# Altium schematic sheet PAGE2-CPU.SchDoc
size 513 x 386 mm
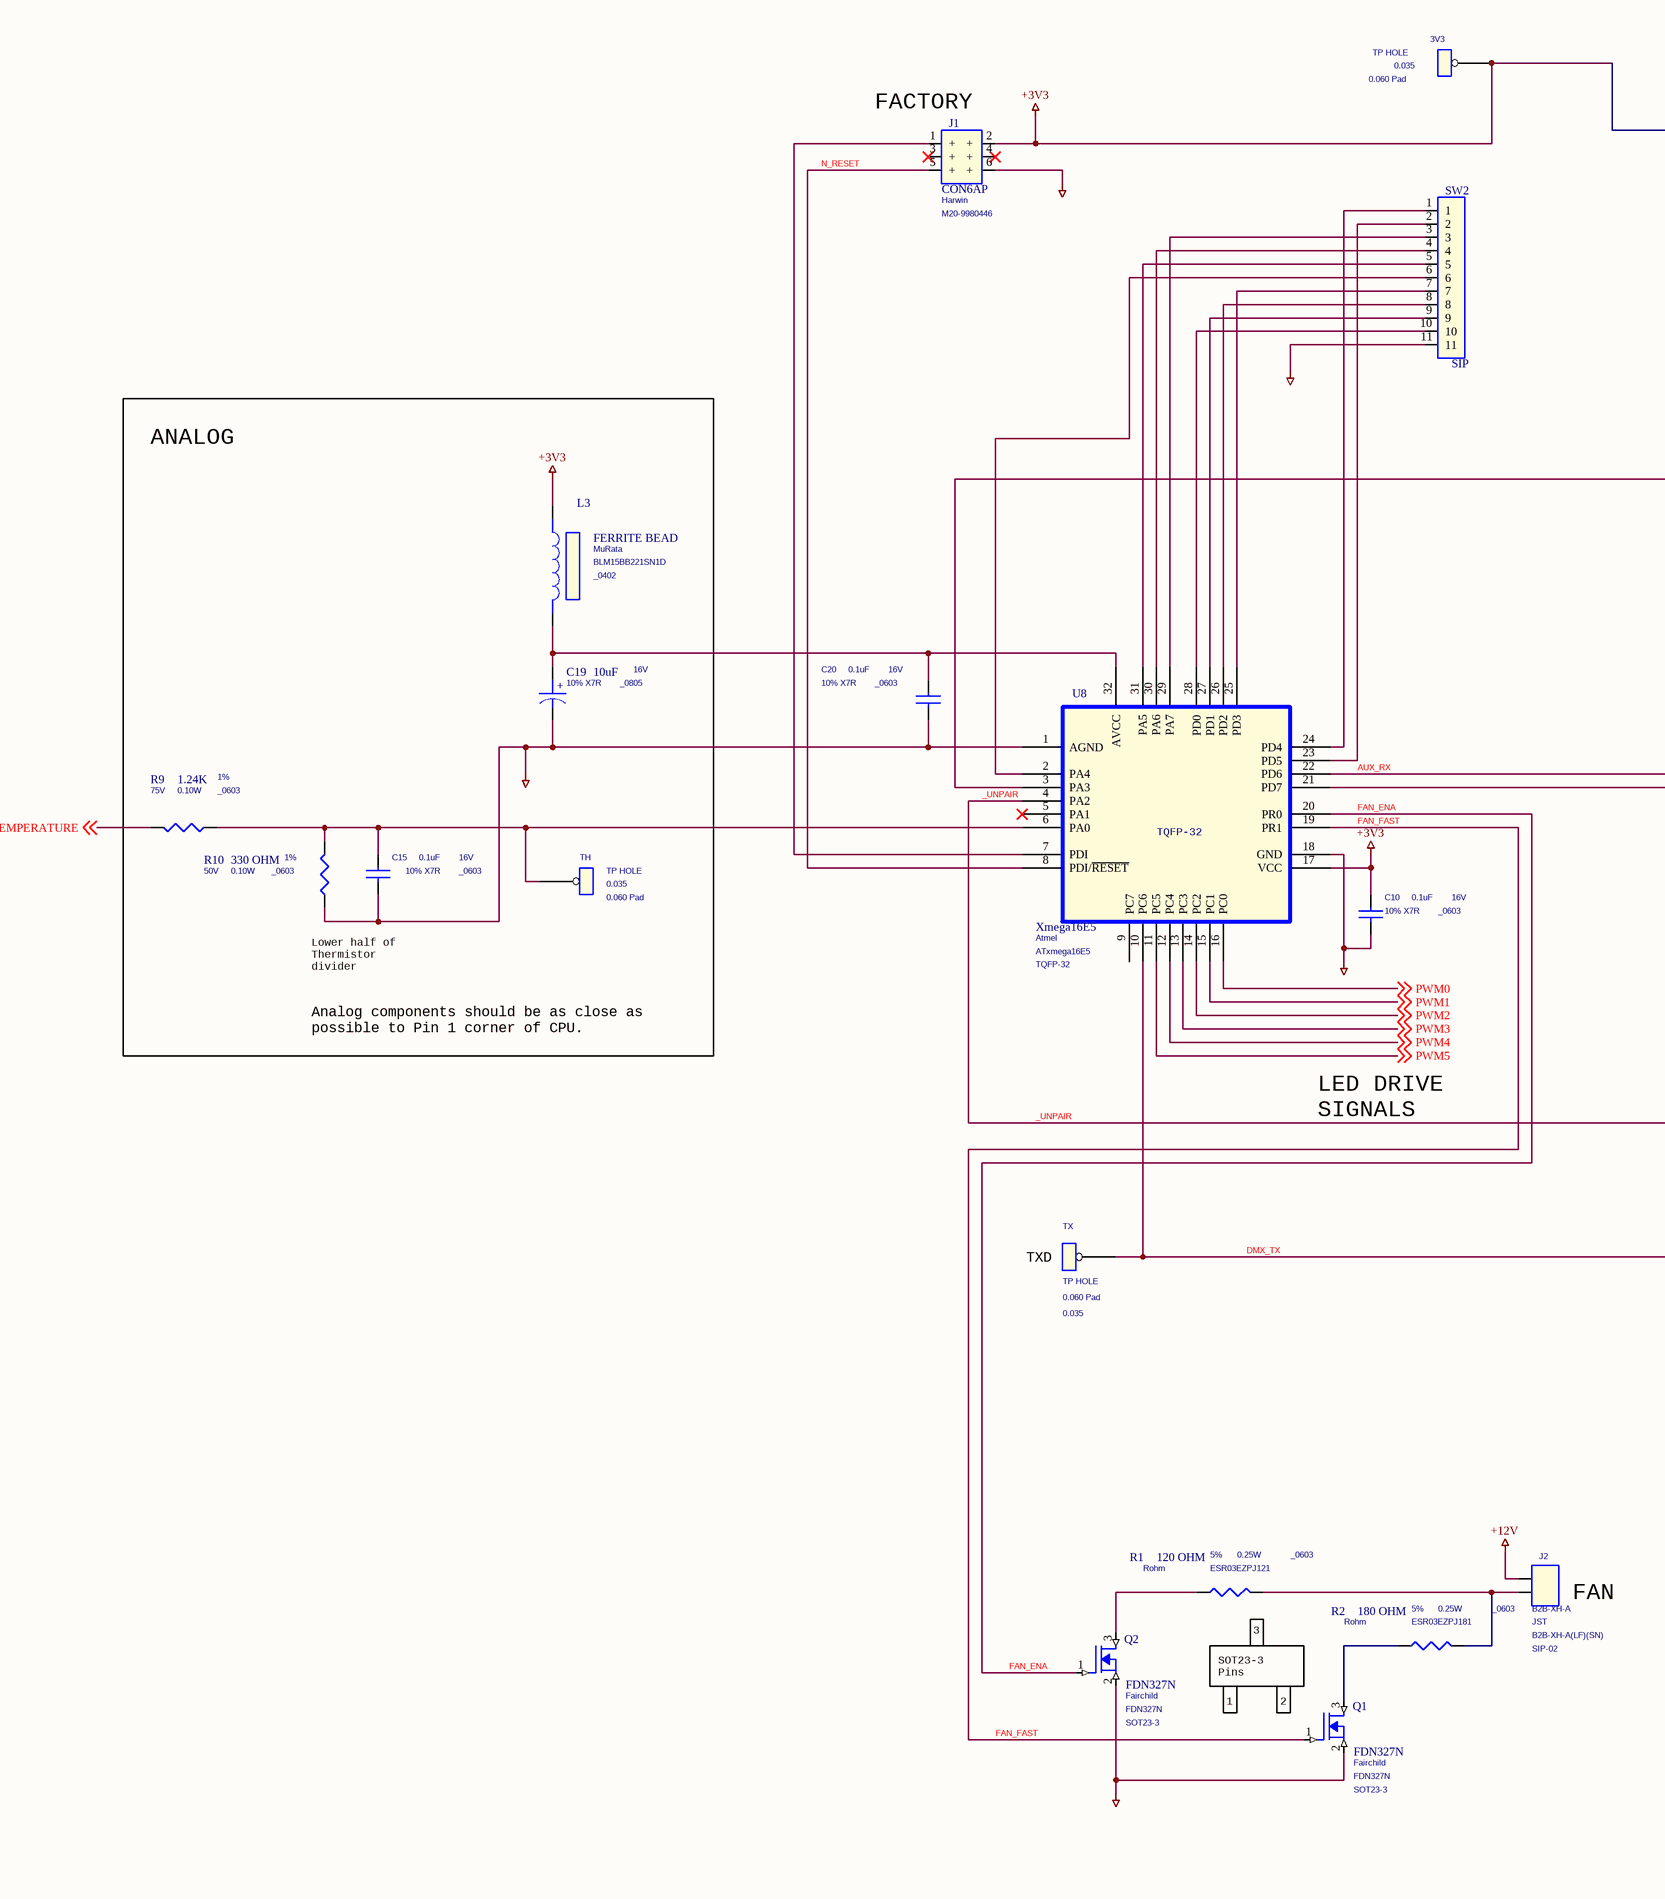
[diagram p0: PAGE2-CPU.SchDoc, left]
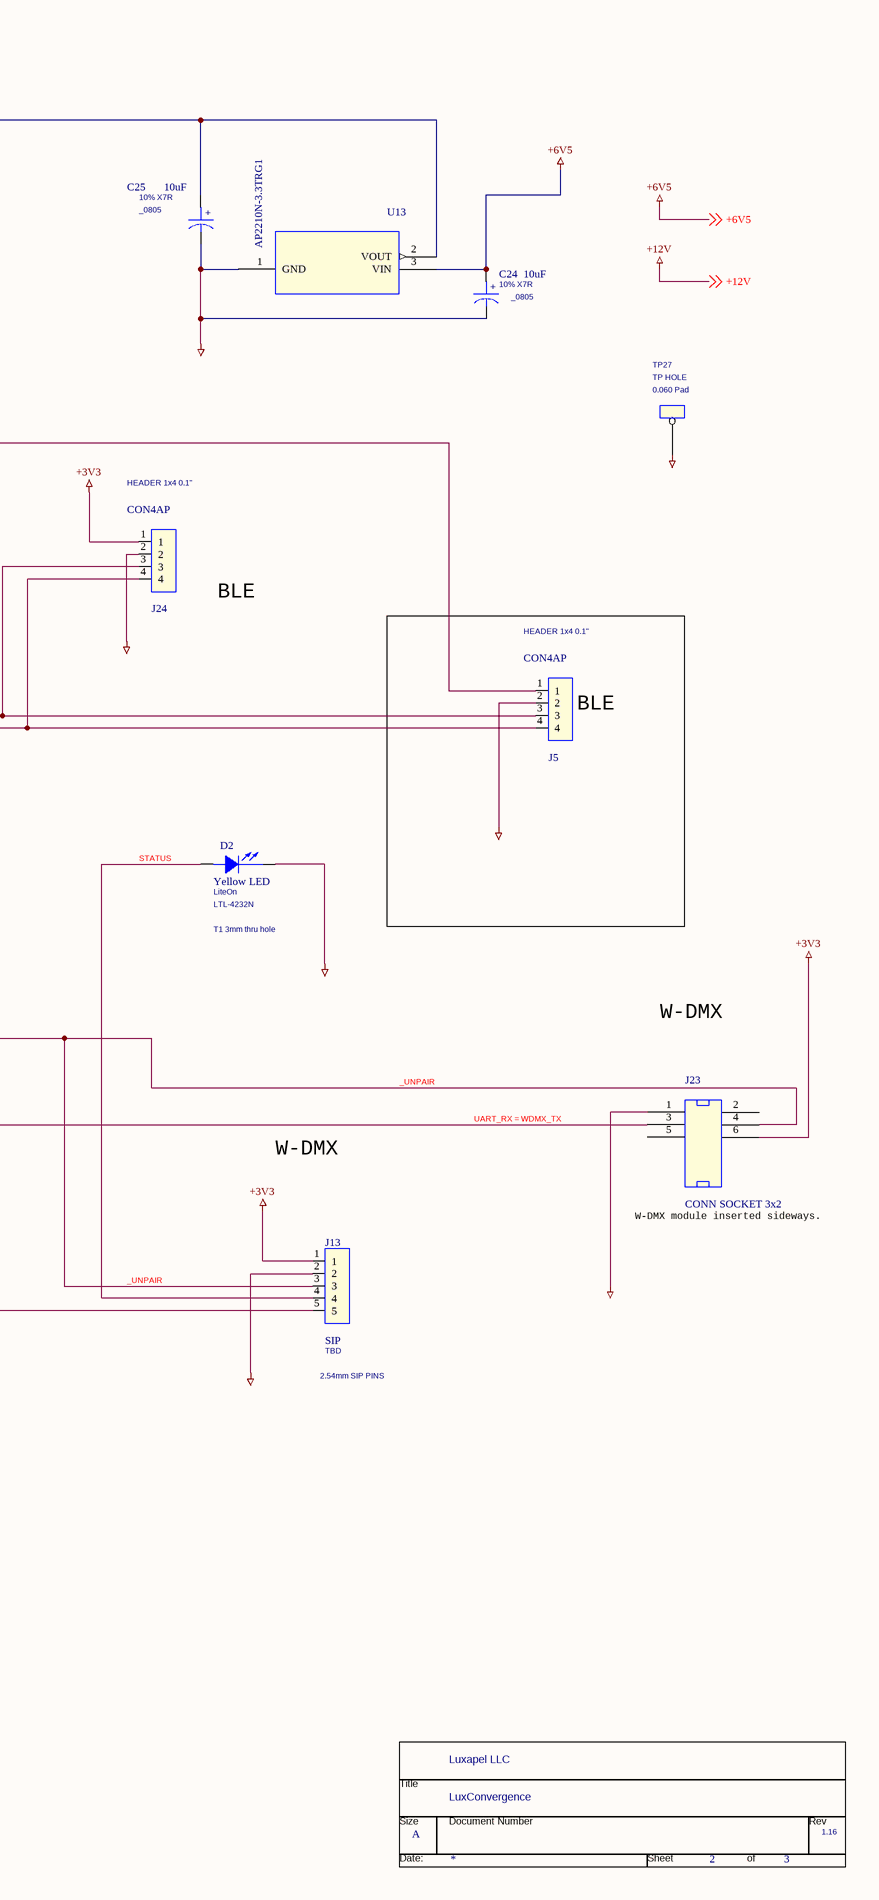
[diagram p1: PAGE2-CPU.SchDoc, right]

## Parts
3V3  TP HOLE  Notes: 0.060 Pad  [0.035]
*  RevCode: 1.16  Title: LuxConvergence  OrgName: Luxapel LLC  Page Size: A  Page Number: 2  Page Count: 3  (hidden comment: TitleBlock1)  (graphical)
C10  0.1uF  Voltage: 16V  Precision: 10% X7R  [_0603]
C15  0.1uF  Precision: 10% X7R  Voltage: 16V  [_0603]
C19  10uF  Voltage: 16V  Precision: 10% X7R  [_0805]
C20  0.1uF  Precision: 10% X7R  Voltage: 16V  [_0603]
C24  10uF  Precision: 10% X7R  [_0805]
C25  10uF  Precision: 10% X7R  [_0805]
D2  Yellow LED  Mfg: LiteOn  P/N: LTL-4232N  [T1 3mm thru hole]
J1  CON6AP  Mfg: Harwin  P/N: M20-9980446  [2x4]
J2  B2B-XH-A  P/N: B2B-XH-A(LF)(SN)  Mfg: JST  [SIP-02]
J5  CON4AP  [HEADER 1x4 0.1"]
J13  SIP  Mfg: TBD  P/N: 2.54mm SIP PINS  [SIP-4]
J23  CONN SOCKET 3x2  [2X3]
J24  CON4AP  PCB Footprint: HEADER 1x4 0.1"  [SIP-4PA]
L3  FERRITE BEAD  Mfg: MuRata  P/N: BLM15BB221SN1D  [_0402]
Q1  FDN327N  Mfg: Fairchild  [SOT23-3]
Q2  FDN327N  Mfg: Fairchild  [SOT23-3]
R1  120 OHM  Precision: 5%  Power: 0.25W  P/N: ESR03EZPJ121  Mfg: Rohm  [_0603]
R2  180 OHM  Precision: 5%  Power: 0.25W  P/N: ESR03EZPJ181  Mfg: Rohm  [_0603]
R9  1.24K  Power: 0.10W  Voltage: 75V  Precision: 1%  [_0603]
R10  330 OHM  Voltage: 50V  Precision: 1%  Power: 0.10W  [_0603]
SW2  SIP  [SIP-4]
TH  TP HOLE  Notes: 0.060 Pad  [0.035]
TP27  TP HOLE  Notes: 0.060 Pad  [0.035]
TX  TP HOLE  Notes: 0.060 Pad  [0.035]
U8  Xmega16E5  P/N: ATxmega16E5  Mfg: Atmel  [TQFP-32]
U13  AP2210N-3.3TRG1  [FP-SOT23-IPC_A]

## Blocks framed on the sheet
ANALOG: C15 C19 L3 R9 R10 TH
BLE: J5

## Nets
+3V3: 3V3.1 C10.1 C25.1 J1.2(+) J13.1 J23.6 J24.1 L3.2 U8.17(VCC) U13.2(VOUT)
+6V5: C24.1 U13.3(VIN) ; off-sheet +6V5
+12V: J2.1 ; off-sheet +12V
GND_POWER.global: C10.2 C15.2 C19.2 C20.2 C24.2 C25.2 D2.2(CATHODE) J1.6(+) J5.2 J13.2 J23.1 J24.2 Q1.2(SOURCE) Q2.2(SOURCE) R10.2 SW2.11 TP27.1 U8.1(AGND) U8.18(GND) U13.1(GND)
_UNPAIR: J13.3 J23.4 U8.4(PA2)
AUX_RX: J5.3 J24.3 U8.22(PD6)
DMX_TX: J13.5 J23.3 TX.1 U8.10(PC6)  [also labelled UART_RX = WDMX_TX]
FAN_ENA: Q2.1(GATE) U8.20(PR0)
FAN_FAST: Q1.1(GATE) U8.19(PR1)
N_RESET: J1.5(+) U8.8(PDI/~{RESET})
PWM0: U8.16(PC0) ; off-sheet PWM0
PWM1: U8.15(PC1) ; off-sheet PWM1
PWM2: U8.14(PC2) ; off-sheet PWM2
PWM3: U8.13(PC3) ; off-sheet PWM3
PWM4: U8.12(PC4) ; off-sheet PWM4
PWM5: U8.11(PC5) ; off-sheet PWM5
STATUS: D2.1(ANODE) J13.4
TEMPERATURE: R9.1 ; off-sheet TEMPERATURE
NetC15_1: C15.1 R9.2 R10.1 TH.1 U8.6(PA0)
NetC19_1: C19.1 C20.1 L3.1 U8.32(AVCC)
NetJ1_1: J1.1(+) U8.7(PDI)
NetJ2_2: J2.2 R1.2 R2.2
NetJ5_1: J5.1 U8.3(PA3)
NetJ5_4: J5.4 J24.4 U8.21(PD7)
NetQ1_3: Q1.3(DRAIN) R2.1
NetQ2_3: Q2.3(DRAIN) R1.1
NetSW2_1: SW2.1 U8.24(PD4)
NetSW2_2: SW2.2 U8.23(PD5)
NetSW2_3: SW2.3 U8.29(PA7)
NetSW2_4: SW2.4 U8.30(PA6)
NetSW2_5: SW2.5 U8.31(PA5)
NetSW2_6: SW2.6 U8.2(PA4)
NetSW2_7: SW2.7 U8.25(PD3)
NetSW2_8: SW2.8 U8.26(PD2)
NetSW2_9: SW2.9 U8.27(PD1)
NetSW2_10: SW2.10 U8.28(PD0)

Not connected (* = marked no-connect by the designer): J1 3(+)* 4(+)*; J23 2(7) 5(3); U8 5(PA1)* 9(PC7)

## Notes on the sheet
- (near J1) FACTORY
- BLE
- Lower half of
  Thermistor
  divider
- Analog components should be as close as
  possible to Pin 1 corner of CPU.
- LED DRIVE
  SIGNALS
- W-DMX
- (near TX) TXD
- W-DMX module inserted sideways.
- (near R1) 3
- (near J2) FAN
- SOT23-3
  Pins
- 1
- (near Q1) 2
- (in symbol CAPACITOR POL/SM) +
- (in symbol TitleBlock1) Title; Size; Document Number; Rev; Date:; Sheet; of

## Library data of the parts
3V3 TH TP27 TX = TEST POINT_1: OrCADviewType: LIBRARY_PART; Name: I16753259; Pin Numbers Visible: False; Pin Names Visible: True; EDIForiginalOrigin: (pt 0 0); EDIFviewName: NORMAL; Implementation Type: <none>; DataSheet: Yes; Graphic: TEST POINT; Color: Default; PCB Footprint: 0.035
* = TitleBlock1: Doc: LuxConvergence_1_0; Page Create Date: March  8, 1995; Page Modify Date: *
C10 = CAPACITOR NON-POL: Name: I16777427; Pin Numbers Visible: False; EDIForiginalOrigin: (pt 0 0); EDIFviewName: NORMAL; Implementation Type: <none>; Color: Default; Mfg: AVX; P/N: 0603YC104KAT2A; Pin Names Visible: False; PCB Footprint: _0603; Graphic: CAPACITOR NON-POL; DataSheet: Yes
C15 = CAPACITOR NON-POL: Name: I16777291; Pin Numbers Visible: False; EDIForiginalOrigin: (pt 0 0); EDIFviewName: NORMAL; P/N: 0603YC104KAT2A; Mfg: AVX; Color: Default; Implementation Type: <none>; Pin Names Visible: False; PCB Footprint: _0603; DataSheet: Yes; Graphic: CAPACITOR NON-POL
C19 = CAPACITOR POL/SM: P/N: CL21B106KOQNNNE; Mfg: Samsung; PCB Footprint: _0805
C20 = CAPACITOR NON-POL: Name: I16777427; Pin Numbers Visible: False; EDIForiginalOrigin: (pt 0 0); EDIFviewName: NORMAL; P/N: 0603YC104KAT2A; Mfg: AVX; Color: Default; Implementation Type: <none>; Pin Names Visible: False; DataSheet: Yes; Graphic: CAPACITOR NON-POL; PCB Footprint: _0603
C24 = CAPACITOR POL/SM: Voltage: 16V; Mfg: Samsung; P/N: CL21B106KOQNNNE; PCB Footprint: _0805
C25 = CAPACITOR POL/SM: P/N: CL21B106KOQNNNE; Mfg: Samsung; Voltage: 16V; PCB Footprint: _0805
D2 = LED: PCB Footprint: T1 3mm thru hole
J1 = CON8AP_0: PCB Footprint: 2x4
J2 = CON2: Pin Numbers Visible: True; EDIForiginalOrigin: (pt 0 0); EDIFviewName: NORMAL; Graphic: CON2.Normal; Implementation Type: <none>; Pin Names Visible: True; Color: Default; PCB Footprint: SIP-02
J5 J24 = CON4AP_5
  J5: PCB Footprint: HEADER 1x4 0.1"
J13 = CON4_9: DataSheet: Yes; PCB Footprint: SIP-4
J23 = CONN SOCKET 6x2_0
L3 = INDUCTOR FERRITE/SM: PCB Footprint: _0402
Q1 Q2 = N DGS_0: Voltage: 20V; Power: 2A; P/N: FDN327N; PCB Footprint: SOT23-3
R1 R2 = RESISTOR/SM: Voltage: 50V; PCB Footprint: _0603
R9 = RESISTOR/SM: Mfg: Vishay; P/N: CRCW06031K24FKEB; PCB Footprint: _0603
R10 = RESISTOR/SM: Mfg: Stackpole; P/N: RMCF0603FT330R; PCB Footprint: _0603
SW2 = CON4_10: Mfg: TBD; P/N: 2mm SIP PINS; PCB Footprint: SIP-4; DataSheet: Yes
U8 = Xmega8E5: PCB Footprint: TQFP-32
U13 = AP2210N-3P3TRG1: Vendor: Diodes Inc; Built_By: EMAMatt; SourceLibrary: DiodesInc2019-12-05; PCB Footprint: SOT_3P3TRG1_DIO; Manufacturer_Part_Number: AP2210N-3.3TRG1; Copyright: Copyright (C) 2018 Accelerated Designs. All rights reserved